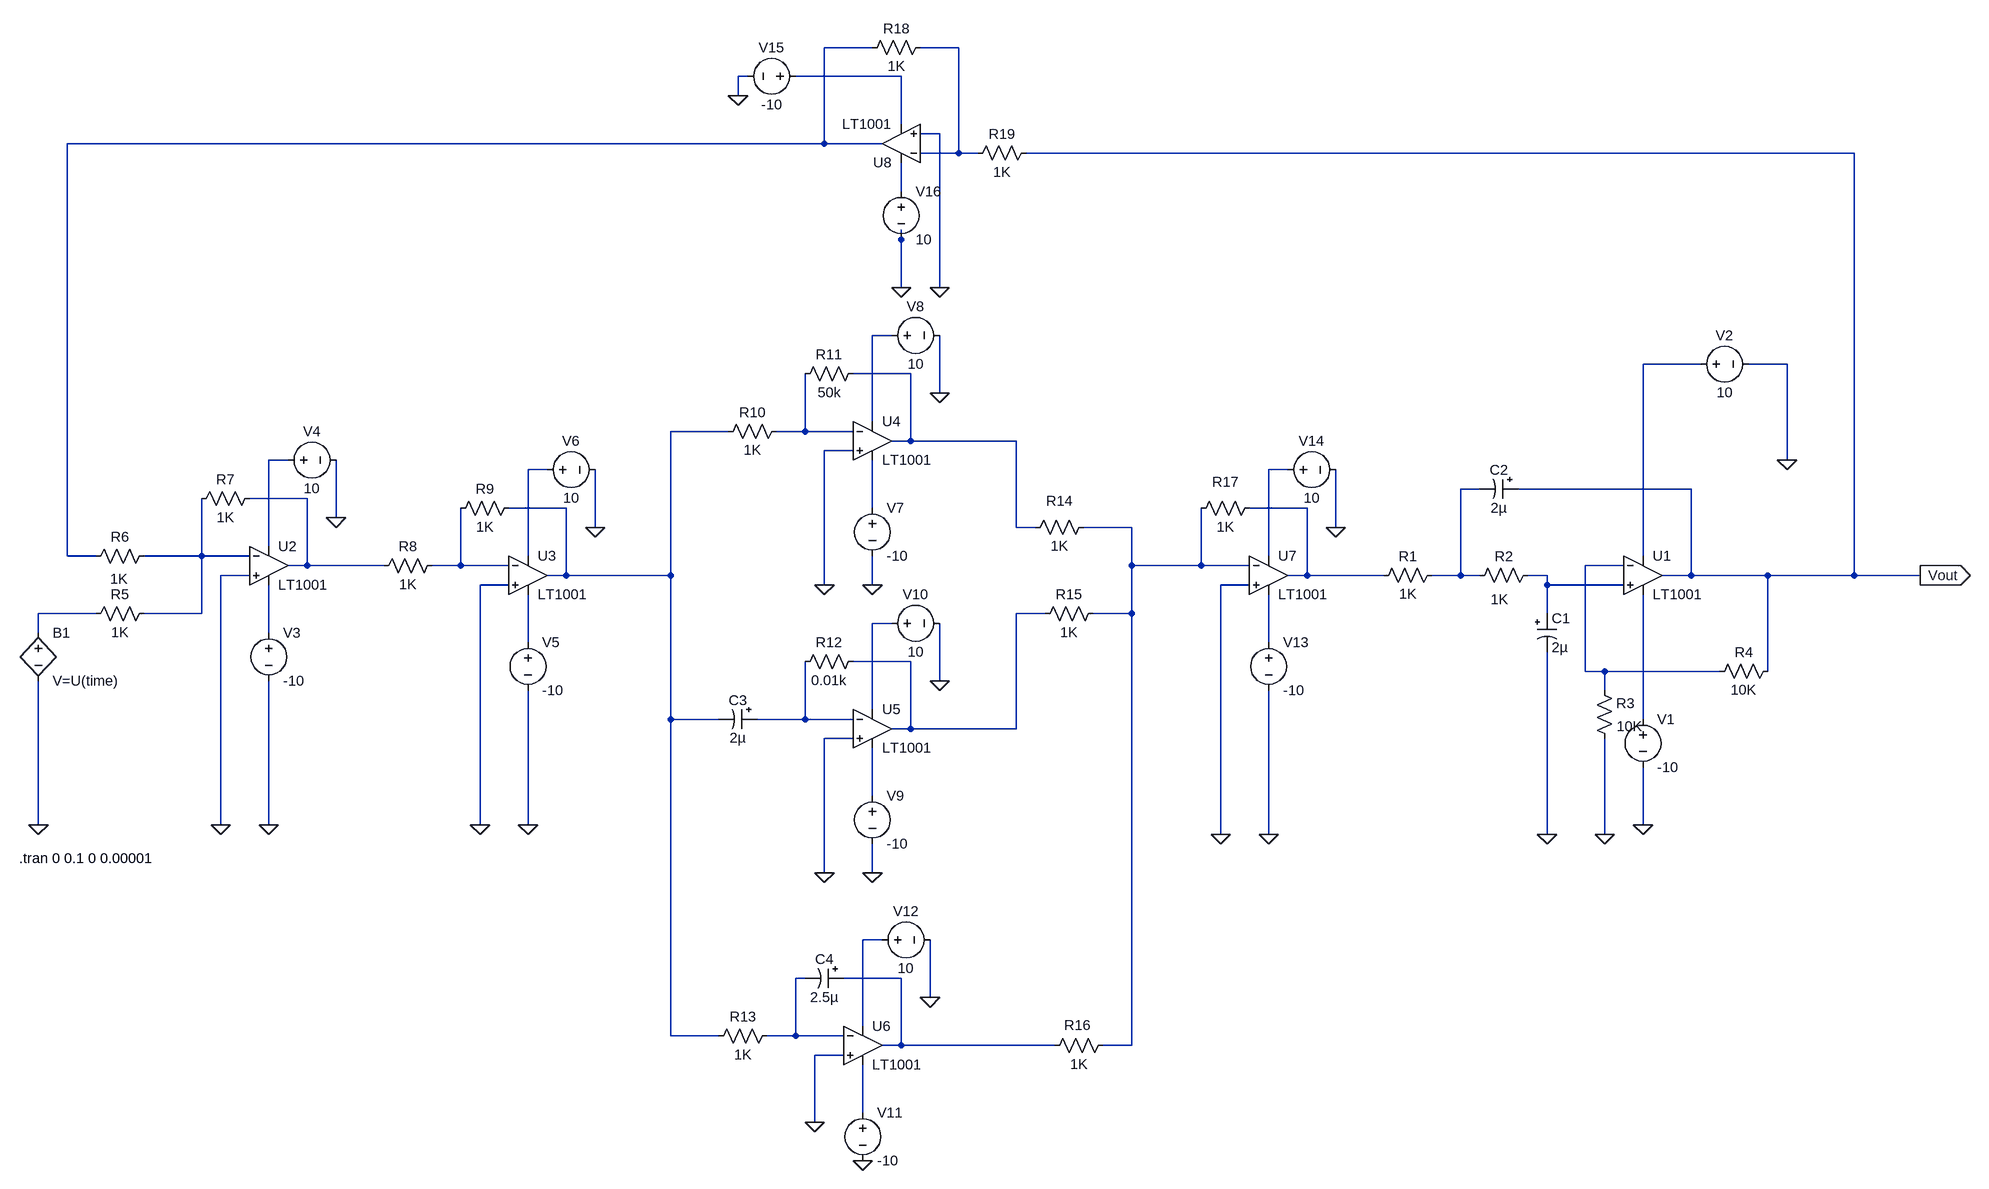
[diagram p0: schematic EC5030_Design Project_2021E171_Design2_Task4.asc]
EC5030_Design Project_2021E171_Design2_Task4.asc, the LTspice schematic file:
Version 4
SHEET 1 2256 1300
WIRE 384 -576 304 -576
WIRE 528 -576 464 -576
WIRE 176 -528 160 -528
WIRE 432 -528 256 -528
WIRE 160 -496 160 -528
WIRE 432 -448 432 -528
WIRE 496 -432 464 -432
WIRE 304 -416 304 -576
WIRE 304 -416 -1008 -416
WIRE 400 -416 304 -416
WIRE 528 -400 528 -576
WIRE 528 -400 464 -400
WIRE 560 -400 528 -400
WIRE 2032 -400 640 -400
WIRE 432 -336 432 -384
WIRE 432 -256 432 -272
WIRE 432 -176 432 -256
WIRE 496 -176 496 -432
WIRE 416 -96 384 -96
WIRE 1776 -48 1680 -48
WIRE 1920 -48 1856 -48
WIRE 448 -32 352 -32
WIRE 496 0 496 -96
WIRE 384 48 384 -96
WIRE 144 64 48 64
WIRE 272 64 272 -32
WIRE 272 64 224 64
WIRE 352 64 272 64
WIRE 448 80 448 -32
WIRE 448 80 416 80
WIRE 624 80 448 80
WIRE 352 96 304 96
WIRE -640 112 -672 112
WIRE 1920 112 1920 -48
WIRE -208 128 -240 128
WIRE 1088 128 1056 128
WIRE 1408 160 1376 160
WIRE 1760 160 1472 160
WIRE -608 176 -704 176
WIRE -176 192 -272 192
WIRE 384 192 384 112
WIRE 1120 192 1024 192
WIRE -560 208 -560 112
WIRE -128 224 -128 128
WIRE 624 224 624 80
WIRE 656 224 624 224
WIRE 816 224 736 224
WIRE 1168 224 1168 128
WIRE -672 256 -672 112
WIRE -1008 272 -1008 -416
WIRE -960 272 -1008 272
WIRE -784 272 -784 176
WIRE -784 272 -880 272
WIRE -704 272 -784 272
WIRE -240 272 -240 128
WIRE 1056 272 1056 128
WIRE 1680 272 1680 -48
WIRE -608 288 -608 176
WIRE -608 288 -640 288
WIRE -480 288 -608 288
WIRE -352 288 -352 192
WIRE -352 288 -400 288
WIRE -272 288 -352 288
WIRE 816 288 816 224
WIRE 944 288 944 192
WIRE 944 288 816 288
WIRE 1024 288 944 288
WIRE 1648 288 1584 288
WIRE -704 304 -752 304
WIRE -176 304 -176 192
WIRE -176 304 -208 304
WIRE 48 304 48 64
WIRE 48 304 -176 304
WIRE 1120 304 1120 192
WIRE 1120 304 1088 304
WIRE 1248 304 1120 304
WIRE 1376 304 1376 160
WIRE 1376 304 1328 304
WIRE 1408 304 1376 304
WIRE 1520 304 1488 304
WIRE 1760 304 1760 160
WIRE 1760 304 1712 304
WIRE 1888 304 1760 304
WIRE 2032 304 2032 -400
WIRE 2032 304 1888 304
WIRE 2144 304 2032 304
WIRE -272 320 -320 320
WIRE 304 320 304 96
WIRE 384 320 384 272
WIRE 1024 320 976 320
WIRE 1520 320 1520 304
WIRE 1648 320 1520 320
WIRE -960 368 -1056 368
WIRE -784 368 -784 272
WIRE -784 368 -880 368
WIRE 672 368 624 368
WIRE 816 368 816 288
WIRE 816 368 752 368
WIRE 1520 368 1520 320
WIRE 416 384 384 384
WIRE -1056 400 -1056 368
WIRE -672 400 -672 320
WIRE -240 416 -240 336
WIRE 1056 416 1056 336
WIRE 448 448 352 448
WIRE 1584 464 1584 288
WIRE 1616 464 1584 464
WIRE 1808 464 1616 464
WIRE 1888 464 1888 304
WIRE 496 480 496 384
WIRE 1616 496 1616 464
WIRE 384 528 384 384
WIRE 48 544 48 304
WIRE 128 544 48 544
WIRE 272 544 272 448
WIRE 272 544 192 544
WIRE 352 544 272 544
WIRE 1680 544 1680 336
WIRE 448 560 448 448
WIRE 448 560 416 560
WIRE 624 560 624 368
WIRE 624 560 448 560
WIRE 352 576 304 576
WIRE 384 672 384 592
WIRE -1056 720 -1056 480
WIRE -752 720 -752 304
WIRE -672 720 -672 480
WIRE -320 720 -320 320
WIRE -240 720 -240 496
WIRE 1680 720 1680 624
WIRE 976 736 976 320
WIRE 1056 736 1056 496
WIRE 1520 736 1520 432
WIRE 1616 736 1616 576
WIRE 304 800 304 576
WIRE 384 800 384 752
WIRE 400 912 368 912
WIRE 272 976 256 976
WIRE 432 976 336 976
WIRE 480 1008 480 912
WIRE 368 1056 368 912
WIRE 48 1072 48 544
WIRE 128 1072 48 1072
WIRE 256 1072 256 976
WIRE 256 1072 208 1072
WIRE 336 1072 256 1072
WIRE 432 1088 432 976
WIRE 432 1088 400 1088
WIRE 688 1088 432 1088
WIRE 816 1088 816 368
WIRE 816 1088 768 1088
WIRE 336 1104 288 1104
WIRE 368 1200 368 1120
WIRE 288 1216 288 1104
FLAG 1616 736 0
FLAG 1520 736 0
FLAG 1680 720 0
FLAG 1920 112 0
FLAG 1168 224 0
FLAG 1056 736 0
FLAG 976 736 0
FLAG 496 0 0
FLAG 384 320 0
FLAG 304 320 0
FLAG -128 224 0
FLAG -240 720 0
FLAG -320 720 0
FLAG -560 208 0
FLAG -672 720 0
FLAG -752 720 0
FLAG -1056 720 0
FLAG 432 -176 0
FLAG 160 -496 0
FLAG 496 480 0
FLAG 384 800 0
FLAG 304 800 0
FLAG 496 -176 0
FLAG 2144 304 Vout
IOPIN 2144 304 Out
FLAG 480 1008 0
FLAG 368 1280 0
FLAG 288 1216 0
SYMBOL voltage -672 384 R0
WINDOW 123 0 0 Left 0
WINDOW 39 0 0 Left 0
SYMATTR InstName V3
SYMATTR Value -10
SYMBOL voltage 1760 -48 R270
WINDOW 0 32 56 VTop 2
WINDOW 3 -32 56 VBottom 2
WINDOW 123 0 0 Left 0
WINDOW 39 0 0 Left 0
SYMATTR InstName V2
SYMATTR Value 10
SYMBOL res -864 256 R90
WINDOW 0 0 56 VBottom 2
WINDOW 3 39 58 VTop 2
SYMATTR InstName R6
SYMATTR Value 1K
SYMBOL polcap 1504 368 R0
SYMATTR InstName C1
SYMATTR Value 2µ
SYMBOL polcap 1472 144 R90
WINDOW 0 0 32 VBottom 2
WINDOW 3 32 32 VTop 2
SYMATTR InstName C2
SYMATTR Value 2µ
SYMBOL OpAmps\\LT1001 1680 240 R0
SYMATTR InstName U1
SYMBOL res 1600 480 R0
WINDOW 0 51 53 Bottom 2
SYMATTR InstName R3
SYMATTR Value 10K
SYMBOL res 1344 288 R90
WINDOW 0 0 56 VBottom 2
WINDOW 3 32 56 VTop 2
SYMATTR InstName R1
SYMATTR Value 1K
SYMBOL OpAmps\\LT1001 1056 240 R0
SYMATTR InstName U7
SYMBOL voltage 1680 528 R0
WINDOW 123 0 0 Left 0
WINDOW 39 0 0 Left 0
SYMATTR InstName V1
SYMATTR Value -10
SYMBOL voltage 400 384 R270
WINDOW 0 32 56 VTop 2
WINDOW 3 -32 56 VBottom 2
WINDOW 123 0 0 Left 0
WINDOW 39 0 0 Left 0
SYMATTR InstName V10
SYMATTR Value 10
SYMBOL res 1904 448 R90
WINDOW 0 0 56 VBottom 2
WINDOW 3 32 56 VTop 2
SYMATTR InstName R4
SYMATTR Value 10K
SYMBOL res 368 -48 R90
WINDOW 0 0 56 VBottom 2
WINDOW 3 32 56 VTop 2
SYMATTR InstName R11
SYMATTR Value 50k
SYMBOL OpAmps\\LT1001 384 16 R0
SYMATTR InstName U4
SYMBOL voltage -240 400 R0
WINDOW 123 0 0 Left 0
WINDOW 39 0 0 Left 0
SYMATTR InstName V5
SYMATTR Value -10
SYMBOL voltage -656 112 R270
WINDOW 0 32 56 VTop 2
WINDOW 3 -32 56 VBottom 2
WINDOW 123 0 0 Left 0
WINDOW 39 0 0 Left 0
SYMATTR InstName V4
SYMATTR Value 10
SYMBOL res -384 272 R90
WINDOW 0 0 56 VBottom 2
WINDOW 3 32 56 VTop 2
SYMATTR InstName R8
SYMATTR Value 1K
SYMBOL res -256 176 R90
WINDOW 0 0 56 VBottom 2
WINDOW 3 32 56 VTop 2
SYMATTR InstName R9
SYMATTR Value 1K
SYMBOL OpAmps\\LT1001 -240 240 R0
SYMATTR InstName U3
SYMBOL voltage 384 176 R0
WINDOW 123 0 0 Left 0
WINDOW 39 0 0 Left 0
SYMATTR InstName V7
SYMATTR Value -10
SYMBOL voltage 400 -96 R270
WINDOW 0 32 56 VTop 2
WINDOW 3 -32 56 VBottom 2
WINDOW 123 0 0 Left 0
WINDOW 39 0 0 Left 0
SYMATTR InstName V8
SYMATTR Value 10
SYMBOL res 240 48 R90
WINDOW 0 0 56 VBottom 2
WINDOW 3 32 56 VTop 2
SYMATTR InstName R10
SYMATTR Value 1K
SYMBOL res 1040 176 R90
WINDOW 0 -12 56 VBottom 2
WINDOW 3 32 56 VTop 2
SYMATTR InstName R17
SYMATTR Value 1K
SYMBOL OpAmps\\LT1001 -672 224 R0
SYMATTR InstName U2
SYMBOL voltage 1056 400 R0
WINDOW 123 0 0 Left 0
WINDOW 39 0 0 Left 0
SYMATTR InstName V13
SYMATTR Value -10
SYMBOL voltage 1072 128 R270
WINDOW 0 32 56 VTop 2
WINDOW 3 -32 56 VBottom 2
WINDOW 123 0 0 Left 0
WINDOW 39 0 0 Left 0
SYMATTR InstName V14
SYMATTR Value 10
SYMBOL res 368 432 R90
WINDOW 0 0 56 VBottom 2
WINDOW 3 32 56 VTop 2
SYMATTR InstName R12
SYMATTR Value 0.01k
SYMBOL res -688 160 R90
WINDOW 0 0 56 VBottom 2
WINDOW 3 32 56 VTop 2
SYMATTR InstName R7
SYMATTR Value 1K
SYMBOL res -864 352 R90
WINDOW 0 0 56 VBottom 2
WINDOW 3 32 56 VTop 2
SYMATTR InstName R5
SYMATTR Value 1K
SYMBOL res 480 -592 R90
WINDOW 0 0 56 VBottom 2
WINDOW 3 32 56 VTop 2
SYMATTR InstName R18
SYMATTR Value 1K
SYMBOL OpAmps\\LT1001 432 -352 R180
SYMATTR InstName U8
SYMBOL res 1504 288 R90
WINDOW 0 0 56 VBottom 2
WINDOW 3 41 63 VTop 2
SYMATTR InstName R2
SYMATTR Value 1K
SYMBOL res 656 -416 R90
WINDOW 0 0 56 VBottom 2
WINDOW 3 32 56 VTop 2
SYMATTR InstName R19
SYMATTR Value 1K
SYMBOL voltage 432 -352 R0
WINDOW 123 0 0 Left 0
WINDOW 39 0 0 Left 0
SYMATTR InstName V16
SYMATTR Value 10
SYMBOL voltage 272 -528 R90
WINDOW 0 -32 56 VBottom 2
WINDOW 3 32 56 VTop 2
WINDOW 123 0 0 Left 0
WINDOW 39 0 0 Left 0
SYMATTR InstName V15
SYMATTR Value -10
SYMBOL OpAmps\\LT1001 384 496 R0
SYMATTR InstName U5
SYMBOL voltage 384 656 R0
WINDOW 123 0 0 Left 0
WINDOW 39 0 0 Left 0
SYMATTR InstName V9
SYMATTR Value -10
SYMBOL voltage -224 128 R270
WINDOW 0 32 56 VTop 2
WINDOW 3 -32 56 VBottom 2
WINDOW 123 0 0 Left 0
WINDOW 39 0 0 Left 0
SYMATTR InstName V6
SYMATTR Value 10
SYMBOL polcap 192 528 R90
WINDOW 0 0 32 VBottom 2
WINDOW 3 32 32 VTop 2
SYMATTR InstName C3
SYMATTR Value 2µ
SYMBOL res 768 352 R90
WINDOW 0 0 56 VBottom 2
WINDOW 3 32 56 VTop 2
SYMATTR InstName R15
SYMATTR Value 1K
SYMBOL res 752 208 R90
WINDOW 0 -12 56 VBottom 2
WINDOW 3 32 56 VTop 2
SYMATTR InstName R14
SYMATTR Value 1K
SYMBOL bv -1056 384 R0
SYMATTR InstName B1
SYMATTR Value V=U(time)
SYMBOL res 784 1072 R90
WINDOW 0 -2 58 VBottom 2
WINDOW 3 32 56 VTop 2
SYMATTR InstName R16
SYMATTR Value 1K
SYMBOL res 224 1056 R90
WINDOW 0 0 56 VBottom 2
WINDOW 3 32 56 VTop 2
SYMATTR InstName R13
SYMATTR Value 1K
SYMBOL OpAmps\\LT1001 368 1024 R0
SYMATTR InstName U6
SYMBOL voltage 368 1184 R0
WINDOW 123 0 0 Left 0
WINDOW 39 0 0 Left 0
SYMATTR InstName V11
SYMATTR Value -10
SYMBOL voltage 384 912 R270
WINDOW 0 32 56 VTop 2
WINDOW 3 -32 56 VBottom 2
WINDOW 123 0 0 Left 0
WINDOW 39 0 0 Left 0
SYMATTR InstName V12
SYMATTR Value 10
SYMBOL polcap 336 960 R90
WINDOW 0 0 32 VBottom 2
WINDOW 3 32 32 VTop 2
SYMATTR InstName C4
SYMATTR Value 2.5µ
TEXT -1088 776 Left 2 !.tran 0 0.1 0 0.00001

The netlist it stands for:
* EC5030_Design Project_2021E171_Design2_Task4.asc
V3 N025 0 -10
V2 N006 0 10
R6 N018 N001 1K
C1 N021 0 2µ
C2 Vout N013 2µ
XU1 N021 N020 N006 N029 Vout LT1001  ; pins In+ In- V+ V- OUT
R3 N020 0 10K
R1 N013 N016 1K
XU7 0 N017 N012 N027 N016 LT1001  ; pins In+ In- V+ V- OUT
V1 N029 0 -10
V10 N024 0 10
R4 Vout N020 10K
R11 N007 N009 50k
XU4 0 N009 N005 N015 N007 LT1001  ; pins In+ In- V+ V- OUT
V5 N026 0 -10
V4 N010 0 10
R8 N019 N014 1K
R9 N008 N019 1K
XU3 0 N019 N011 N026 N008 LT1001  ; pins In+ In- V+ V- OUT
V7 N015 0 -10
V8 N005 0 10
R10 N009 N008 1K
R17 N016 N017 1K
XU2 0 N018 N010 N025 N014 LT1001  ; pins In+ In- V+ V- OUT
V13 N027 0 -10
V14 N012 0 10
R12 N023 N028 0.01k
R7 N014 N018 1K
R5 N018 N022 1K
R18 N002 N001 1K
XU8 0 N002 N004 N003 N001 LT1001  ; pins In+ In- V+ V- OUT
R2 N021 N013 1K
R19 Vout N002 1K
V16 N004 0 10
V15 N003 0 -10
XU5 0 N028 N024 N030 N023 LT1001  ; pins In+ In- V+ V- OUT
V9 N030 0 -10
V6 N011 0 10
C3 N028 N008 2µ
R15 N017 N023 1K
R14 N017 N007 1K
B1 N022 0 V=U(time)
R16 N017 N033 1K
R13 N032 N008 1K
XU6 0 N032 N031 N034 N033 LT1001  ; pins In+ In- V+ V- OUT
V11 N034 0 -10
V12 N031 0 10
C4 N033 N032 2.5µ
.tran 0 0.1 0 0.00001
.lib LTC.lib
.backanno
.end